# Altium schematic sheet FDCAN.SchDoc: FDCAN
size A4; CompanyName: STMicroelectronics; Organization: Microcontrollers Division; DocumentNumber: 18; SheetNumber: 8; SheetTotal: 19
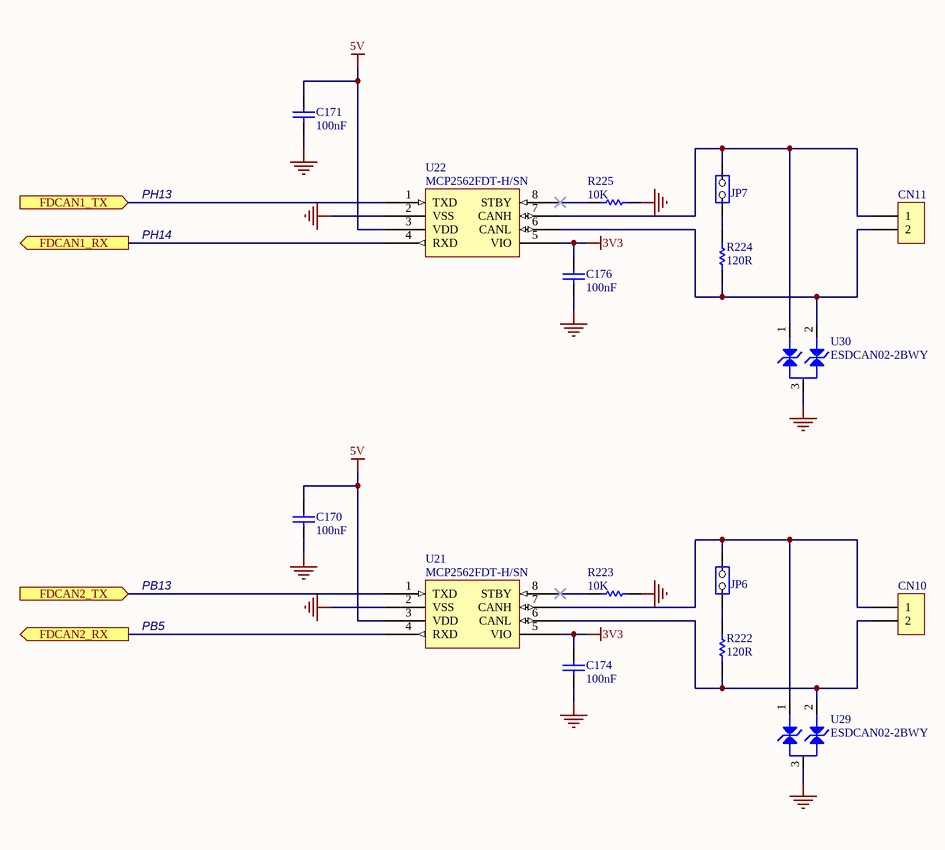
[diagram p0: FDCAN.SchDoc]

## Parts
C170  value 100nF  [C0402]  (hidden comment: Capacitor)
C171  value 100nF  [C0402]  (hidden comment: Capacitor)
C174  value 100nF  [C0402]  (hidden comment: Capacitor)
C176  value 100nF  [C0402]  (hidden comment: Capacitor)
CN10  Header 2x1  [CON_988-JIUBABA_PHFS25-11-02-G0B115-T-1]  (value not drawn)
CN11  Header 2x1  [CON_988-JIUBABA_PHFS25-11-02-G0B115-T-1]  (value not drawn)
JP6  Jumper Header 2x1  [CON_SAMTEC_TSW-102-07-G-S]  (value not drawn)
JP7  Jumper Header 2x1  [CON_SAMTEC_TSW-102-07-G-S]  (value not drawn)
R222  value 120R  [R0402]  (hidden comment: Resistor)
R223  value 10K  [R0402]  (hidden comment: Resistor)
R224  value 120R  [R0402]  (hidden comment: Resistor)
R225  value 10K  [R0402]  (hidden comment: Resistor)
U21  value MCP2562FDT-H/SN  [ICC_SO8_5X4_P127]  (hidden comment: MCP2562FD)
U22  value MCP2562FDT-H/SN  [ICC_SO8_5X4_P127]  (hidden comment: MCP2562FD)
U29  value ESDCAN02-2BWY  [DIO_SOT323]  (hidden comment: ESD-TRANSIL-DUAL-BIDIR)
U30  value ESDCAN02-2BWY  [DIO_SOT323]  (hidden comment: ESD-TRANSIL-DUAL-BIDIR)

## Ports
FDCAN1_RX (out), FDCAN1_TX (in), FDCAN2_RX (out), FDCAN2_TX (in)

## Nets
3V3: C174.2 C176.2 U21.5(VIO) U22.5(VIO)
5V: C170.2 C171.2 U21.3(VDD) U22.3(VDD)
GND: C170.1 C171.1 C174.1 C176.1 R223.2 R225.2 U21.2(VSS) U22.2(VSS) U29.3 U30.3
FDCAN1_RX: U22.4(RXD) ; port FDCAN1_RX
FDCAN1_TX: U22.1(TXD) ; port FDCAN1_TX
FDCAN2_RX: U21.4(RXD) ; port FDCAN2_RX
FDCAN2_TX: U21.1(TXD) ; port FDCAN2_TX
NetCN10_1: CN10.1 JP6.2(NO) U21.7(CANH) U29.1
NetCN10_2: CN10.2 R222.1 U21.6(CANL) U29.2
NetCN11_1: CN11.1 JP7.2(NO) U22.7(CANH) U30.1
NetCN11_2: CN11.2 R224.1 U22.6(CANL) U30.2
NetJP6_1: JP6.1(COMMON) R222.2
NetJP7_1: JP7.1(COMMON) R224.2
NetR223_1: R223.1 U21.8(STBY)
NetR225_1: R225.1 U22.8(STBY)

## Notes on the sheet
- PH13
- PH14
- PB13
- PB5
- Title:
- Project:
- Size:
- Revision:
- Variant:
- A4
- -
- Date:
- Reference:
- Sheet:
- of

## Library data of the parts
C170 C171 C174 C176 = MCD-00006: Capacitor, MLCC, 100nF, 16V, X7R, +/-10%, 0402, T=0.5mm; Manufacturer_Part_Number: CC0402KRX7R7BB104; Manufacturer: YAGEO; Part_Preference: Recommended; Partial_Alternate_Internal_Part_Number: MCD-03299; Component_Country_Of_Origin: China; ID: 2474; Order_Code_RS: 9402047; ShowFields: YES; Internal_Part_Number: MCD-00006; Status: Released; Part_Type: Capacitor; Package: 0402; ComponentLink1URL: http://tunmcdsvn.tun.st.com/Component_Documentation_Library/Trunk/Capacitor/YAGEO_X7R_Series; Order_Code_Digikey: 311-1338-1-ND; Order_Code_Farnell: 9402047
CN10 CN11 = MCD-00314: Header, 2x1, 2.54mm, VR, TH, Height 6mm/3mm; Part_Type: Connector; Manufacturer_Part_Number: PHFS25-11-02-G0B115-T-1; Manufacturer: JIUBABA; Part_Preference: Alternate; Provided_By: Subcon; Initial_Board_Reference: MB1311; Alternate_EMS: A; Component_Country_Of_Origin: Unknown; ID: 2554; ShowFields: YES; Internal_Part_Number: MCD-00314; Value: header 2x1; Status: Released; ComponentLink1Description: Jiubaba_PHFS25-11XXXXXXXXXX.pdf; ComponentLink1URL: http://tunmcdsvn.tun.st.com/Component_Documentation_Library/Trunk/Connector/JIUBABA_PHFS25-11-02-G0B115-T-1/; ECCN_US: n/a; ECCN_EU: n/a; Order_Code_Digikey: N/A; Order_Code_Farnell: N/A; Order_Code_RS: N/A
JP6 JP7 = MCD-00045: Header, 2x1, 2,54mm, VR, TH, Height 5.84mm/2.54mm; Manufacturer_Part_Number: TSW-102-07-G-S; Manufacturer: SAMTEC; Part_Type: Connector; Full_Alternate_Internal_Part_Number: MCD-02390; Part_Preference: Recommended; Partial_Alternate_Internal_Part_Number: MCD-02957, MCD-03720, MCD-04249; Provided_By: Subcon; Initial_Board_Reference: mb1274; Component_Country_Of_Origin: China, Costa Rica, Malaysia, USA, Vietnam; ID: 2545; Order_Code_RS: 2505044; ShowFields: YES; Internal_Part_Number: MCD-00045; Value: Header 2x1; Status: Released; ComponentLink1Description: Samtec_connector_TSW-HTSW-series.pdf; ECCN_US: n/a; ECCN_EU: n/a; ComponentLink1URL: http://tunmcdsvn.tun.st.com/Component_Documentation_Library/Trunk/Connector/SAMTEC_TSW_Series/; Order_Code_Digikey: SAM1029-02-ND; Order_Code_Farnell: 2505044
R222 R224 = MCD-00194: Resistor,120R,0402,1%,1/16W; Manufacturer_Part_Number: RC0402FR-07120RL; Manufacturer: YAGEO; Part_Preference: Recommended; Provided_By: Subcon; Component_Country_Of_Origin: China; ID: 2674; ShowFields: YES; Internal_Part_Number: MCD-00194; Status: Released; Part_Type: Resistor; Package: 0402; ComponentLink1Description: Yageo_Resistor_RC0402-series.pdf; ComponentLink1URL: http://tunmcdsvn.tun.st.com/Component_Documentation_Library/Trunk/Resistor/YAGEO_RC_L_Series; ECCN_US: n/a; ECCN_EU: n/a; Order_Code_Digikey: 311-120LRCT-ND; Order_Code_Farnell: 9239120; Order_Code_RS: N/A
R223 R225 = MCD-00053: Resistor,10K,0402,1%,1/16W; Manufacturer_Part_Number: RC0402FR-0710KL; Manufacturer: YAGEO; BMS_Part_Number: 9131590; Part_Preference: Recommended; Provided_By: subcon; Initial_Board_Reference: MB1274; Component_Country_Of_Origin: China; ID: 2539; Order_Code_RS: 9239359; ShowFields: YES; Internal_Part_Number: MCD-00053; Status: Released; Part_Type: Resistor; Package: 0402; ComponentLink1Description: Yageo_Resistor_RC0402-series.pdf; ComponentLink1URL: http://tunmcdsvn.tun.st.com/Component_Documentation_Library/Trunk/Resistor/YAGEO_RC_L_Series; ECCN_US: n/a; ECCN_EU: n/a; Order_Code_Digikey: 311-10.0KLRCT-ND; Order_Code_Farnell: 9239359
U21 U22 = MCD-00129: High-Speed CAN Flexible Data Rate Transceiver; Part_Type: IC; Manufacturer: MICROCHIP; Part_Preference: Recommended; ECCN_US: EAR99; ECCN_EU: NEC; Provided_By: Subcon; Initial_Board_Reference: MB1262; Component_Country_Of_Origin: Unknown; ID: 2737; ShowFields: YES; Internal_Part_Number: MCD-00129; Status: Released; Manufacturer_Part_Number: MCP2562FDT-H/SN; ComponentLink1Description: Microchip_CAN Transceiver_MCP2562FD.pdf; ComponentLink1URL: http://tunmcdsvn.tun.st.com/Component_Documentation_Library/Trunk/IC/MICROCHIP_MCP2562FDT-H_SN; Order_Code_Digikey: MCP2562FDT-H/SN-ND; Order_Code_Farnell: N/A; Order_Code_RS: N/A; Package: SO-8
U29 U30 = MCD-01062: Automotive dual-line Transil, transient voltage suppressor / (TVS) for CAN bus. Compliant with interfaces in automotive: CAN-FD, LIN, FlexRay, MOST, SENT, USB; Part_Type: Diode; Manufacturer: STMICROELECTRONICS; BMS_Part_Number: 9179023; Manufacturer_HQ_COO: EU; Part_Preference: Recommended; Provided_By: Subcon; Initial_Board_Reference: MB1331; Component_Country_Of_Origin: China; ID: 3427; Order_Code_RS: 124-1109; ShowFields: YES; Internal_Part_Number: MCD-01062; Status: Released; Manufacturer_Part_Number: ESDCAN02-2BWY; Package: SOT323-3; ComponentLink1Description: STM_ESD_ESDCAN02-2BWY; ComponentLink1URL: http://tunmcdsvn.tun.st.com/Component_Documentation_Library/Trunk/Diode/STMICROELECTRONICS_ESDCAN0x-2BWY_Series; ECCN_US: n/a; ECCN_EU: n/a; Order_Code_Digikey: 497-15845-2-ND; Order_Code_Farnell: 2522909